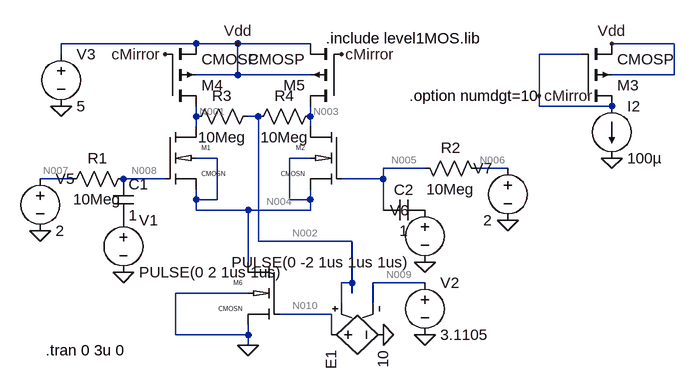
[diagram p0: schematic singleOMP_cmfb_ideal.asc]
singleOMP_cmfb_ideal.asc, the LTspice schematic file:
Version 4
SHEET 1 944 680
WIRE 160 16 -48 16
WIRE 224 16 160 16
WIRE 336 16 224 16
WIRE 896 16 800 16
WIRE -48 32 -48 16
WIRE 752 32 688 32
WIRE 224 64 224 16
WIRE 224 64 160 64
WIRE 336 64 224 64
WIRE 896 64 896 16
WIRE 896 64 800 64
WIRE 688 96 688 32
WIRE 688 112 688 96
WIRE 800 112 688 112
WIRE 160 128 160 112
WIRE 256 128 240 128
WIRE 336 128 336 112
WIRE 160 144 160 128
WIRE 336 144 336 128
WIRE 192 192 160 192
WIRE 336 192 304 192
WIRE 512 208 448 208
WIRE 640 208 592 208
WIRE -32 224 -80 224
WIRE 112 224 48 224
WIRE 448 224 448 208
WIRE 448 224 384 224
WIRE 160 256 160 240
WIRE 192 256 192 192
WIRE 192 256 160 256
WIRE 304 256 304 192
WIRE 336 256 336 240
WIRE 336 256 304 256
WIRE 160 272 160 256
WIRE 240 272 160 272
WIRE 336 272 336 256
WIRE 336 272 240 272
WIRE 448 272 448 224
WIRE 256 320 256 128
WIRE 400 320 256 320
WIRE 240 352 240 272
WIRE 400 384 400 320
WIRE 400 384 384 384
WIRE 512 384 432 384
WIRE 240 400 128 400
WIRE 400 400 400 384
WIRE 384 416 384 384
WIRE 432 416 432 384
WIRE 368 432 288 432
WIRE 128 464 128 400
WIRE 240 464 240 448
WIRE 240 464 128 464
WIRE 368 464 368 432
WIRE 240 480 240 464
FLAG 48 368 0
FLAG -48 112 0
FLAG 112 32 cMirror
FLAG 384 32 cMirror
FLAG 224 16 Vdd
FLAG 800 16 Vdd
FLAG 800 192 0
FLAG 688 96 cMirror
FLAG 240 480 0
FLAG -80 304 0
FLAG 512 352 0
FLAG 640 288 0
FLAG 512 464 0
FLAG 448 464 0
SYMBOL cmosn 112 144 R0
SYMATTR InstName M1
SYMATTR Value2 l=0.36u w=0.72u
SYMBOL cmosn 384 144 M0
SYMATTR InstName M2
SYMATTR Value2 l=0.36u w=0.72u
SYMBOL voltage 48 272 R0
WINDOW 123 24 116 Left 2
WINDOW 39 0 0 Left 2
SYMATTR InstName V1
SYMATTR Value PULSE(0 2 1us 1us)
SYMBOL voltage -48 16 R0
WINDOW 123 0 0 Left 2
WINDOW 39 0 0 Left 2
SYMATTR InstName V3
SYMATTR Value 5
SYMBOL cmosp 112 112 M180
SYMATTR InstName M4
SYMATTR Value2 l=0.36u w=0.36u
SYMBOL cmosp 384 112 R180
SYMATTR InstName M5
SYMATTR Value2 l=0.36u w=0.36u
SYMBOL cmosp 752 112 M180
SYMATTR InstName M3
SYMATTR Value2 l=0.36u w=0.36u
SYMBOL current 800 112 R0
WINDOW 123 0 0 Left 2
WINDOW 39 0 0 Left 2
SYMATTR InstName I2
SYMATTR Value 100µ
SYMBOL cmosn 288 352 M0
SYMATTR InstName M6
SYMATTR Value2 l=0.36u w=3.6u
SYMBOL cap 32 224 R0
SYMATTR InstName C1
SYMATTR Value 1
SYMBOL res -48 240 R270
WINDOW 0 32 56 VTop 2
WINDOW 3 0 56 VBottom 2
SYMATTR InstName R1
SYMATTR Value 10Meg
SYMBOL voltage -80 208 R0
WINDOW 123 24 116 Left 2
WINDOW 39 0 0 Left 2
SYMATTR InstName V5
SYMATTR Value 2
SYMBOL voltage 512 256 M0
WINDOW 123 24 116 Left 2
WINDOW 39 0 0 Left 2
SYMATTR InstName V6
SYMATTR Value PULSE(0 -2 1us 1us 1us)
SYMBOL res 608 224 M270
WINDOW 0 32 56 VTop 2
WINDOW 3 0 56 VBottom 2
SYMATTR InstName R2
SYMATTR Value 10Meg
SYMBOL voltage 640 192 M0
WINDOW 123 24 116 Left 2
WINDOW 39 0 0 Left 2
SYMATTR InstName V7
SYMATTR Value 2
SYMBOL cap 448 288 R270
WINDOW 0 32 32 VTop 2
WINDOW 3 0 32 VBottom 2
SYMATTR InstName C2
SYMATTR Value 1
SYMBOL res 144 144 R270
WINDOW 0 32 56 VTop 2
WINDOW 3 0 56 VBottom 2
SYMATTR InstName R3
SYMATTR Value 10Meg
SYMBOL res 240 144 R270
WINDOW 0 32 56 VTop 2
WINDOW 3 0 56 VBottom 2
SYMATTR InstName R4
SYMATTR Value 10Meg
SYMBOL voltage 512 368 R0
WINDOW 123 0 0 Left 2
WINDOW 39 0 0 Left 2
SYMATTR InstName V2
SYMATTR Value 3.1105
SYMBOL e 352 464 M90
SYMATTR InstName E1
SYMATTR Value 10
TEXT 360 8 Left 2 !.include level1MOS.lib
TEXT -72 488 Left 2 !.tran 0 3u 0
TEXT 488 96 Left 2 !.option numdgt=10

The netlist it stands for:
* singleOMP_cmfb_ideal.asc
M1 N001 N008 N004 N004 CMOSN l=0.36u w=0.72u
M2 N003 N005 N004 N004 CMOSN l=0.36u w=0.72u
V1 P001 0 PULSE(0 2 1us 1us)
V3 Vdd 0 5
M4 N001 cMirror Vdd Vdd CMOSP l=0.36u w=0.36u
M5 N003 cMirror Vdd Vdd CMOSP l=0.36u w=0.36u
M3 cMirror cMirror Vdd Vdd CMOSP l=0.36u w=0.36u
I2 cMirror 0 100µ
M6 N004 N010 0 0 CMOSN l=0.36u w=3.6u
C1 N008 P001 1
R1 N007 N008 10Meg
V5 N007 0 2
V6 P002 0 PULSE(0 -2 1us 1us 1us)
R2 N006 N005 10Meg
V7 N006 0 2
C2 N005 P002 1
R3 N001 N002 10Meg
R4 N002 N003 10Meg
V2 N009 0 3.1105
E1 N010 0 N002 N009 10
.model NMOS NMOS
.model PMOS PMOS
.lib standard.mos
.include level1MOS.lib
.tran 0 3u 0
.option numdgt=10
.lib tsmc018.lib
.backanno
.end

* Results of the author's LTspice run, read from the files saved beside the schematic
* Operating Point, zero values left out:
*   V(n001) = 3.193 V
*   V(n008) = 2 V
*   V(n004) = 1.006 V
*   V(n003) = 3.193 V
*   V(n005) = 2 V
*   V(vdd) = 5 V
*   V(cmirror) = 3.113 V
*   V(n010) = 826.7 mV
*   V(n007) = 2 V
*   V(n006) = 2 V
*   V(n002) = 3.193 V
*   V(n009) = 3.111 V
*   Id(M3) = -100 µA
*   Ib(M3) = 1.897 pA
*   Is(M3) = 100 µA
*   Id(M5) = -99.38 µA
*   Ib(M5) = 1.817 pA
*   Is(M5) = 99.38 µA
*   Id(M4) = -99.38 µA
*   Ib(M4) = 1.817 pA
*   Is(M4) = 99.38 µA
*   Id(M6) = 198.8 µA
*   Ib(M6) = -1.016 pA
*   Is(M6) = -198.8 µA
*   Id(M2) = 99.38 µA
*   Ib(M2) = -2.197 pA
*   Is(M2) = -99.38 µA
*   Id(M1) = 99.38 µA
*   Ib(M1) = -2.197 pA
*   Is(M1) = -99.38 µA
*   I(C2) = 2 pA
*   I(C1) = 2 pA
*   I(I2) = 100 µA
*   I(R2) = 2 pA
*   I(R1) = 2 pA
*   I(V7) = -2 pA
*   I(V6) = 2 pA
*   I(V5) = -2 pA
*   I(V3) = -298.8 µA
*   I(V1) = 2 pA
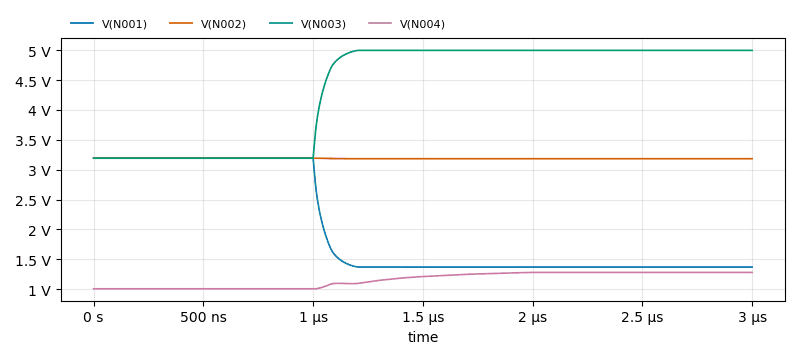
[diagram p1: Transient Analysis of singleOMP_cmfb_ideal.asc, plotted from the saved traces]
* Transient Analysis, 1 run:
*   V(N001): min 1.37 V, max 3.193 V, average 2.004 V, rms 2.179 V, last 1.37 V
*   V(N002): min 3.184 V, max 3.193 V, average 3.187 V, rms 3.187 V, last 3.184 V
*   V(N003): min 3.193 V, max 4.999 V, average 4.37 V, rms 4.452 V, last 4.999 V
*   V(N004): min 1.006 V, max 1.28 V, average 1.158 V, rms 1.165 V, last 1.28 V